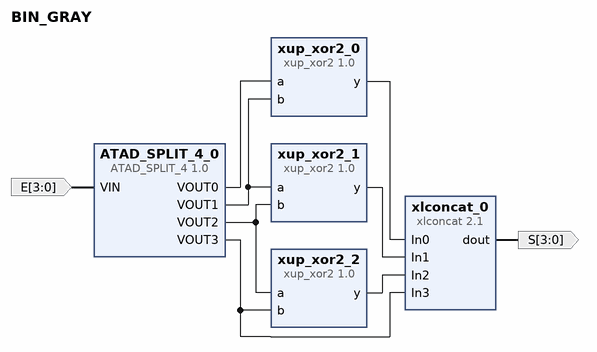
[diagram p0: block diagram of the top level]
# Vivado block design BIN_GRAY, xc7a100tcsg324-1, Vivado 2020.1
create_bd_design BIN_GRAY

create_bd_port -dir I -from 3 -to 0 E
create_bd_port -dir O -from 3 -to 0 S

create_bd_cell -type ip -vlnv xilinx.com:user:ATAD_SPLIT_4:1.0 ATAD_SPLIT_4_0
create_bd_cell -type ip -vlnv xilinx.com:xup:xup_xor2:1.0 xup_xor2_0
create_bd_cell -type ip -vlnv xilinx.com:xup:xup_xor2:1.0 xup_xor2_1
create_bd_cell -type ip -vlnv xilinx.com:xup:xup_xor2:1.0 xup_xor2_2
create_bd_cell -type ip -vlnv xilinx.com:ip:xlconcat:2.1 xlconcat_0
set_property -dict {CONFIG.NUM_PORTS 4} [get_bd_cells xlconcat_0]

# ---- connections ----

connect_bd_net [get_bd_ports E] [get_bd_pins ATAD_SPLIT_4_0/VIN]
connect_bd_net [get_bd_pins ATAD_SPLIT_4_0/VOUT1] [get_bd_pins xup_xor2_0/b] [get_bd_pins xup_xor2_1/a]
connect_bd_net [get_bd_pins ATAD_SPLIT_4_0/VOUT3] [get_bd_pins xup_xor2_2/b] [get_bd_pins xlconcat_0/In3]
connect_bd_net [get_bd_pins ATAD_SPLIT_4_0/VOUT0] [get_bd_pins xup_xor2_0/a]
connect_bd_net [get_bd_pins ATAD_SPLIT_4_0/VOUT2] [get_bd_pins xup_xor2_1/b] [get_bd_pins xup_xor2_2/a]
connect_bd_net [get_bd_pins xup_xor2_0/y] [get_bd_pins xlconcat_0/In0]
connect_bd_net [get_bd_pins xup_xor2_1/y] [get_bd_pins xlconcat_0/In1]
connect_bd_net [get_bd_pins xup_xor2_2/y] [get_bd_pins xlconcat_0/In2]
connect_bd_net [get_bd_pins xlconcat_0/dout] [get_bd_ports S]

validate_bd_design
save_bd_design
